# Altium schematic sheet DC_5V.SchDoc
size A4
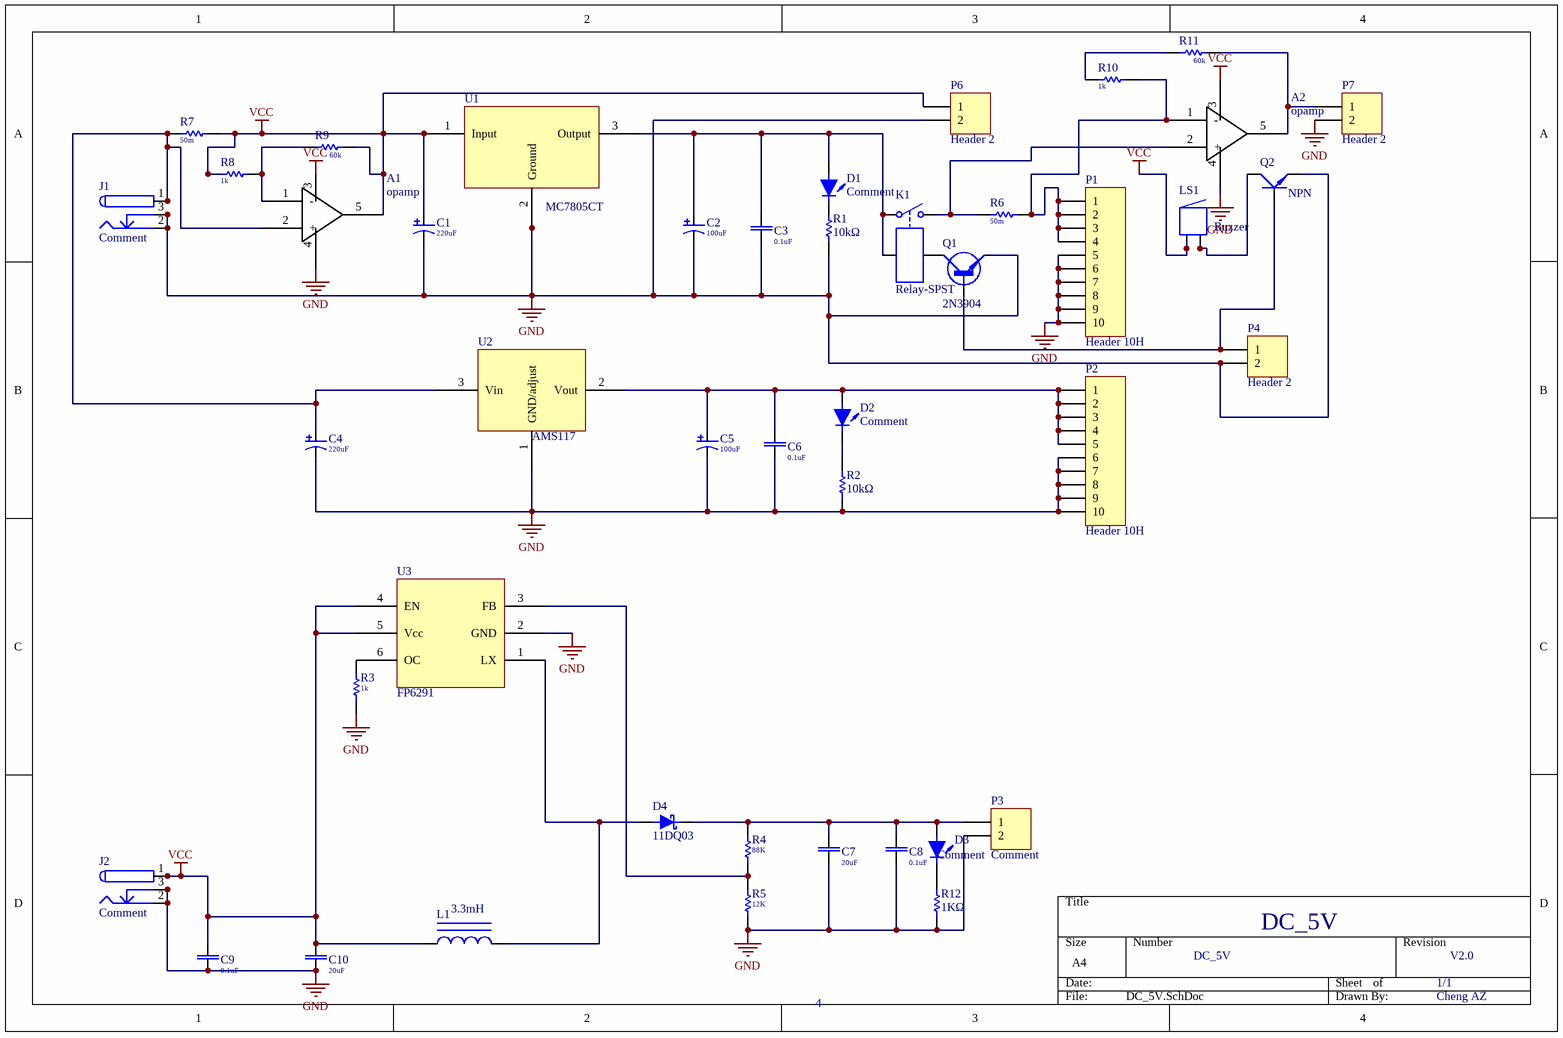
[diagram p0: DC_5V.SchDoc]

## Parts
A1  opamp  [CAN_8/D_9]
A2  opamp  [CAN_8/D_9]
C1  value 220uF  [CAPPR1.27-1.7x2.8]  (hidden comment: Comment)
C2  value 100uF  [CAPPR1.27-1.7x2.8]  (hidden comment: Comment)
C3  value 0.1uF  [CAPC1005L]  (hidden comment: Cap Semi)
C4  value 220uF  [CAPPR1.27-1.7x2.8]  (hidden comment: Comment)
C5  value 100uF  [CAPPR1.27-1.7x2.8]  (hidden comment: Comment)
C6  value 0.1uF  [CAPC1005L]  (hidden comment: Cap Semi)
C7  value 20uF  [CAPC1005L]  (hidden comment: Cap Semi)
C8  value 0.1uF  [CAPC1005L]  (hidden comment: Cap Semi)
C9  value 0.1uF  [CAPC1005L]  (hidden comment: Cap Semi)
C10  value 20uF  [CAPC1005L]  (hidden comment: Cap Semi)
D1  Comment  [DSO-F2/D6.1]
D2  Comment  [DSO-F2/D6.1]
D3  Comment  [DSO-F2/D6.1]
D4  11DQ03  [DIO10.46-5.3x2.8]
J1  Comment  [KLD-0202]
J2  Comment  [KLD-0202]
K1  Relay-SPST  [DIP-P4]
L1  3.3mH  [AXIAL-0.9]
LS1  Buzzer  [ABSM-1574]
P1  Header 10H  [HDR1X10H]
P2  Header 10H  [HDR1X10H]
P3  Comment  [HDR1X2]
P4  Header 2  [HDR1X2]
P6  Header 2  [HDR1X2]
P7  Header 2  [HDR1X2]
Q1  2N3904  [BCY-W3/E4]
Q2  NPN  [BCY-W3]
R1  value 10kΩ  [RES 0805N (2012)]  (hidden comment: Comment)
R2  value 10kΩ  [RES 0805N (2012)]  (hidden comment: Comment)
R3  value 1k  [RES 0805N (2012)]  (hidden comment: Comment)
R4  value 88K  [RES 0805N (2012)]  (hidden comment: Comment)
R5  value 12K  [RES 0805N (2012)]  (hidden comment: Comment)
R6  50m  [RES 0805N (2012)]
R7  50m  [RES 0805N (2012)]
R8  1k  [RES 0805N (2012)]
R9  60k  [RES 0805N (2012)]
R10  1k  [RES 0805N (2012)]
R11  60k  [RES 0805N (2012)]
R12  value 1KΩ  [RES 0805N (2012)]  (hidden comment: Comment)
U1  MC7805CT  [TO-220-3]
U2  AMS117  [TO-252]
U3  FP6291  [TO-220-6]

## Nets
GND: A1.4 A2.4 C1.2 C2.2 C3.2 C4.2 C5.2 C6.2 C7.2 C8.2 C9.2 C10.2 J1.2 J1.2A J1.2B J1.3 J1.3A J1.3B J2.2 J2.2A J2.2B J2.3 J2.3A J2.3B P1.5 P1.6 P1.7 P1.8 P1.9 P1.10 P2.6 P2.7 P2.8 P2.9 P2.10 P3.2 P4.2 P6.2 P7.2 Q1.1(E) Q2.3(E) R1.1 R2.1 R3.1 R5.1 R12.1 U1.2(Ground) U2.1(GND/adjust) U3.2(GND)
VCC: A1.5 A2.3 C1.1 C9.1 C10.1 J2.1 J2.1A J2.1B L1.1 LS1.1 LS1.1A P6.1 R7.2 R8.1 R9.2 U1.1(Input) U3.4(EN) U3.5(Vcc)
NetA1_1: A1.1(-) R8.2 R9.1
NetA1_2: A1.2(+) C4.1 J1.1 J1.1A J1.1B R7.1 U2.3(Vin)
NetA2_1: A2.1(-) P1.1 P1.2 P1.3 P1.4 R6.2 R10.1
NetA2_2: A2.2(+) K1.2 R6.1
NetA2_5: A2.5 P7.1 R11.2
NetC2_1: C2.1 C3.1 D1.1(A) K1.1 K1.3 U1.3(Output)
NetC5_1: C5.1 C6.1 D2.1(A) P2.1 P2.2 P2.3 P2.4 P2.5 U2.2(Vout)
NetC7_1: C7.1 C8.1 D3.1(A) D4.2(K) P3.1 R4.2
NetD2_2: D2.2(K) R2.2
NetD3_2: D3.2(K) R12.2
NetD4_1: D4.1(A) L1.2 U3.1(LX)
NetK1_4: K1.4 Q1.3(C)
NetLS1_2: LS1.2 LS1.2A Q2.1(C)
NetP4_1: P4.1 Q1.2(B) Q2.2(B)
NetR3_2: R3.2 U3.6(OC)
NetR4_1: R4.1 R5.2 U3.3(FB)
NetR10_2: R10.2 R11.1

Not connected (* = marked no-connect by the designer): A1 3; D1 2(K); R1 2

## Notes on the sheet
- DC_5V
- 1/1
- V2.0
- 4
- Cheng AZ
- Labels drawn without touching a wire or pin: VCC

## Library data of the parts
C1 C2 C4 C5 = Cap Pol2: Polarized Capacitor (Axial); Published: 8-Jun-2000; LatestRevisionDate: 17-Jul-2002; LatestRevisionNote: Re-released for DXP Platform.; PackageReference: POLAR0.8; Publisher: Altium Limited
C3 C6-C10 = Cap Semi: Capacitor (Semiconductor SIM Model); Published: 8-Jun-2000; LatestRevisionDate: 29-May-2009; LatestRevisionNote: IPC-7351 Footprint Added.; PackageReference: C1206; Publisher: Altium Limited; PackageDescription: Chip Capacitor
D1-D3 = LED2: Typical RED, GREEN, YELLOW, AMBER GaAs LED; Published: 8-Jun-2000; LatestRevisionDate: 17-Jul-2002; LatestRevisionNote: Re-released for DXP Platform.; PackageVersion: Feb-2002; PackageReference: 3.2X1.6X1.1; Publisher: Altium Limited
D4 = Diode 11DQ03: Schottky Rectifier; Published: 8-Jun-2000; LatestRevisionDate: 17-Jul-2002; LatestRevisionNote: Re-released for DXP Platform.; DatasheetVersion: Dec-1997; PackageReference: DO-204AL; Publisher: Altium Limited; Code_JEDEC: DO-204-AL; ComponentLink1Description: Manufacturer Link; ComponentLink1URL: http://www.irf.com/; ComponentLink2Description: Datasheet; ComponentLink2URL: http://www.irf.com/product-info/datasheets/data/11dq03.pdf
J1 J2 = PWR2.5: Low Voltage Power Supply Connector; Published: 17-Dec-2003; DatasheetDocument: 09-May-2002; Publisher: Altium Limited; ComponentLink1Description: Manufacturer Link; ComponentLink1URL: http://domino.kycon.com/internet/Products.html
K1 = Relay-SPST: Single-Pole Single-Throw Relay; Published: 24-Mar-1999; LatestRevisionDate: 17-Jul-2002; LatestRevisionNote: Re-released for DXP Platform.; PackageReference: MODULE4; Publisher: Altium Limited
L1 = Inductor Iron: Magnetic-Core Inductor; Published: 24-Mar-1999; LatestRevisionDate: 17-Jul-2002; LatestRevisionNote: Re-released for DXP Platform.; PackageReference: AXIAL-0.9; Publisher: Altium Limited
LS1 = Buzzer: Magnetic Transducer Buzzer; Published: 24-Mar-1999; LatestRevisionDate: 17-Dec-2003; LatestRevisionNote: Schematic revised, PCB Footprint replaced.; DatasheetVersion: 17-Dec-2003; PackageReference: ABSM-1574; Publisher: Altium Limited; ComponentLink1Description: Manufacturer Link; ComponentLink1URL: http://www.megastar.com/linecard/buzzmode/index.php
P1 P2 = Header 10H: Header, 10-Pin, Right Angle; LatestRevisionDate: 17-Jul-2002; LatestRevisionNote: Re-released for DXP Platform.; Publisher: Altium Limited
P3 P4 P6 P7 = Header 2: Header, 2-Pin; LatestRevisionDate: 17-Jul-2002; LatestRevisionNote: Re-released for DXP Platform.; Publisher: Altium Limited
Q1 = 2N3904: NPN General Purpose Amplifier; Published: 8-Jun-2000; LatestRevisionDate: 15-Jan-2003; LatestRevisionNote: PCB Footprint 'BCY-W3/D4.7' replaced; DatasheetVersion: 1997; PackageVersion: Sep-1998; PackageReference: TO-92A; Publisher: Altium Limited; Code_JEDEC: TO-92A; ComponentLink1Description: Manufacturer Link; ComponentLink1URL: http://www.fairchildsemi.com/; ComponentLink2Description: Datasheet; ComponentLink2URL: http://www.fairchildsemi.com/ds/2N%2F2N3904.pdf
Q2 = NPN: NPN Bipolar Transistor; Published: 8-Jun-2000; LatestRevisionDate: 17-Jul-2002; LatestRevisionNote: Re-released for DXP Platform.; PackageReference: TO-226; Publisher: Altium Limited; Code_JEDEC: TO-226-AA
R1 R2 R12 = Res Semi: Semiconductor Resistor; Published: 8-Jun-2000; LatestRevisionDate: 17-Jul-2002; LatestRevisionNote: Re-released for DXP Platform.; PackageReference: AXIAL-0.5; Publisher: Altium Limited
R3-R11 = Res1: Resistor; Published: 8-Jun-2000; LatestRevisionDate: 17-Jul-2002; LatestRevisionNote: Re-released for DXP Platform.; PackageReference: AXIAL-0.3; Publisher: Altium Limited
  R6 R7: Value: 50m
  R8 R10: Value: 1k
  R9 R11: Value: 60k
U1 = MC7805CT: 1.0A Positive Voltage Regulators
U2 = AMS117-3.3: 1A output current and to operate  down to 1V input-to-output differential.
U3 = FP6291: 1.0A Positive Voltage Regulator PWM